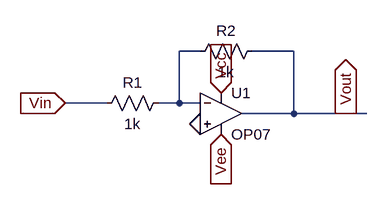
[diagram p0: schematic inverter.asc]
inverter.asc, the LTspice schematic file:
Version 4
SHEET 1 880 680
WIRE 144 48 112 48
WIRE 288 48 224 48
WIRE 0 128 -64 128
WIRE 112 128 112 48
WIRE 112 128 80 128
WIRE 144 128 112 128
WIRE 288 144 288 48
WIRE 288 144 208 144
WIRE 368 144 288 144
WIRE 400 144 368 144
FLAG -64 128 Vin
IOPIN -64 128 In
FLAG 368 144 Vout
IOPIN 368 144 Out
FLAG 144 160 0
FLAG 176 112 Vcc
IOPIN 176 112 In
FLAG 176 176 Vee
IOPIN 176 176 In
SYMBOL OpAmps\\OP07 176 80 R0
SYMATTR InstName U1
SYMBOL res 96 112 R90
WINDOW 0 0 56 VBottom 2
WINDOW 3 32 56 VTop 2
SYMATTR InstName R1
SYMATTR Value 1k
SYMBOL res 240 32 R90
WINDOW 0 0 56 VBottom 2
WINDOW 3 32 56 VTop 2
SYMATTR InstName R2
SYMATTR Value 1k

The netlist it stands for:
* inverter.asc
XU1 0 N001 Vcc Vee Vout LT1001  ; OP07, pins In+ In- V+ V- OUT
R1 N001 Vin 1k
R2 Vout N001 1k
.lib LTC.lib
.backanno
.end